# Altium schematic sheet Power.SchDoc
size 420 x 297 mm; Address1: Address1; Address2: Address2; Address3: Address3; Address4: Address4; SheetNumber: 1; Scale: 1:1; Разраб.: Иванов; Обозначение документа: Power; Пров.: Петров; Утв.: Сидоров; Наименование организации: ОАО "Концерн "МПО-Гидроприбор"; Перв. применение: АБВГ.123456.000; Наименование изделия 1: Плата; Наименование изделия 2: Схема электрическая; Наименование изделия 3: принципиальная; Нач. отд.: Нач. отд.; Фамилия нач. отд.: Сидоров
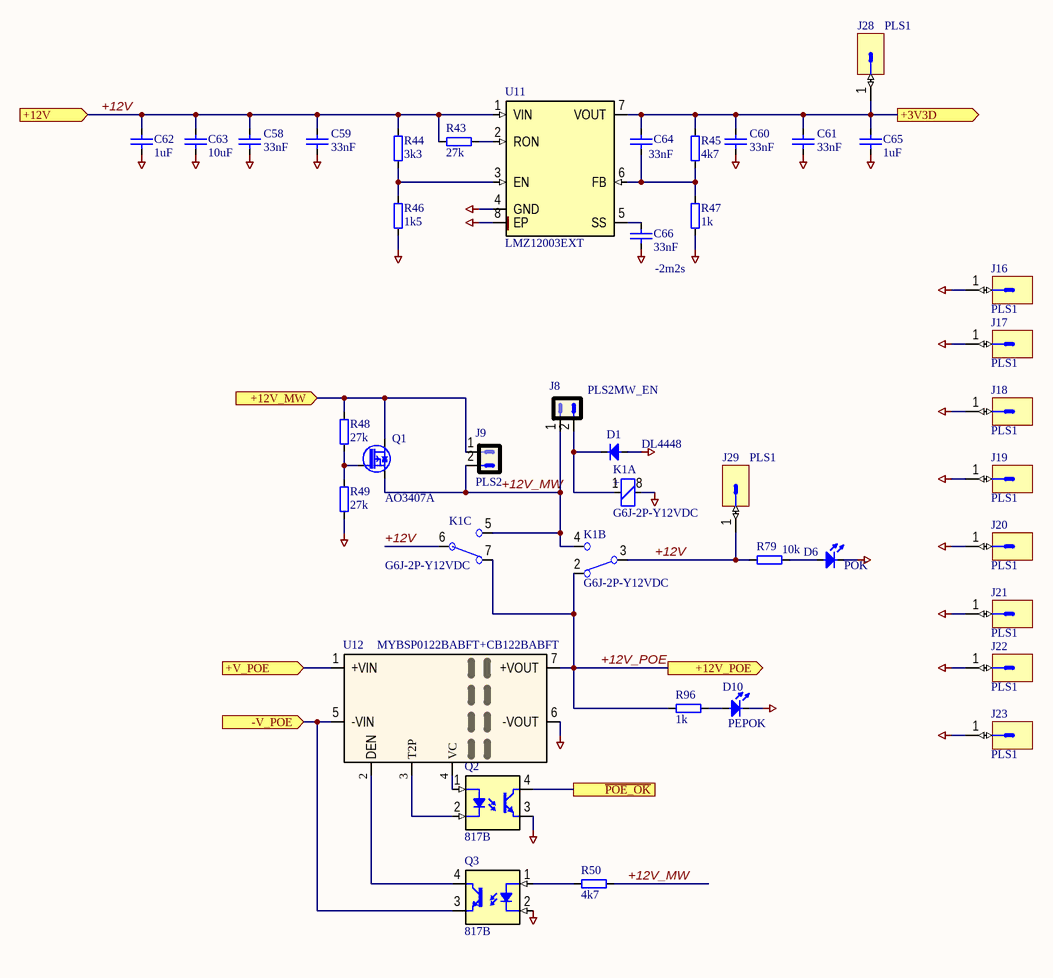
[diagram p0: Power.SchDoc]

## Parts
C58  33nF  [CAPC1608X87N]
C59  33nF  [CAPC1608X87N]
C60  33nF  [CAPC1608X87N]
C61  33nF  [CAPC1608X87N]
C62  1uF  [SMD0805CAP]
C63  10uF  [SMD0805CAP]
C64  33nF  [SMD0805CAP]
C65  1uF  [SMD0805CAP]
C66  33nF  [CAPC1608X87N]
D1  DL4448  [DIOMELF3515N]
D6  POK  [LED_OSRAM_LGR971]
D10  PEPOK  [LED_OSRAM_LGR971]
J8  PLS2MW_EN  [PLS2]
J9  PLS2  [PLS2]
J16  PLS1  [PLS1]
J17  PLS1  [PLS1]
J18  PLS1  [PLS1]
J19  PLS1  [PLS1]
J20  PLS1  [PLS1]
J21  PLS1  [PLS1]
J22  PLS1  [PLS1]
J23  PLS1  [PLS1]
J28  PLS1  [PLS1]
J29  PLS1  [PLS1]
K1  G6J-2P-Y12VDC  [REL_OMRON_G6J-2P-Y]  (parts A,B,C of 3)
Q1  AO3407A  [SOT95P229X119-3N]
Q2  817B  [DIP4-300]
Q3  817B  [DIP4-300]
R43  27k  [SMD0805RES]
R44  3k3  [SMD0805RES]
R45  4k7  [RESC1608X64N]
R46  1k5  [SMD0805RES]
R47  1k  [SMD0805RES]
R48  27k  [SMD0805RES]
R49  27k  [SMD0805RES]
R50  4k7  [SMD0805RES]
R79  10k  [SMD0805RES]
R96  1k  [SMD0805RES]
U11  LMZ12003EXT  [NATIONAL_TO-PMOD-7 (TZA07A)]
U12  MYBSP0122BABFT+CB122BABFT  [MURATA_MYBSP0122BABFT_0 - DUPLICATE]

## Ports
+3V3D (out), +12V (in), +12V_MW (in), +12V_POE (out), +V_POE (in), -V_POE (in), ~{POE_OK}

## Nets
GND: C58.1 C59.1 C60.1 C61.1 C62.1 C63.1 C65.1 C66.1 D1.2(A) D6.1(C) D10.1(C) J16.1 J17.1 J18.1 J19.1 J20.1 J21.1 J22.1 J23.1 K1.8 Q2.3(E) Q3.2(C) R46.2 R47.2 R49.2 U11.4(GND) U11.8(EP) U12.6(-VOUT)
+3V3D: C60.2 C61.2 C64.2 C65.2 J28.1 R45.1 U11.7(VOUT) ; port +3V3D
+12V: C58.2 C59.2 C62.2 C63.2 J29.1 K1.3(C) K1.6(C) R43.1 R44.1 R79.1 U11.1(VIN) ; port +12V
+12V_MW: J8.1 J9.2 K1.4(NO) K1.5(NO) Q1.2(S) R50.2
+12V_MW: J9.1 Q1.3(D) R48.1 ; port +12V_MW  [a separate net that carries the same name]
+12V_POE: K1.2(NC) K1.7(NC) R96.1 U12.7(+VOUT) ; port +12V_POE
+V_POE: U12.1(+VIN) ; port +V_POE
-V_POE: Q3.3(E) U12.5(-VIN) ; port -V_POE
~{POE_OK}: Q2.4(C) ; port ~{POE_OK}
NetC64_1: C64.1 R45.2 R47.1 U11.6(FB)
NetC66_2: C66.2 U11.5(SS)
NetD1_1: D1.1(C) J8.2 K1.1
NetD6_2: D6.2(A) R79.2
NetD10_2: D10.2(A) R96.2
NetQ1_1: Q1.1(G) R48.2 R49.1
NetQ2_1: Q2.1(A) U12.4(VC)
NetQ2_2: Q2.2(C) U12.3(T2P)
NetQ3_1: Q3.1(A) R50.1
NetQ3_4: Q3.4(C) U12.2(DEN)
NetR43_2: R43.2 U11.2(RON)
NetR44_2: R44.2 R46.1 U11.3(EN)

## Notes on the sheet
- -2m2s
- Подп. и дата
- Инв. № дубл.
- Взам. инв. №
- Инв. № подл.
- Изм.
- Лист
- № докум.
- Подп.
- Дата
- Копировал
- Формат А3
- (in symbol G6J-2P-Y 12VDC, part A) +

## Library data of the parts
C58-C61 C66 = C0603: Чип конденсатор 0603; Voltage: 50V; Vendor: Vishay; DielectricType: X5R; SMD Solders: 2; Solder Option: RM; Tolerance: 20%; Pkg: SMD0603; Device: Cap603; Value: 33nF; Price: 2
C62-C65 = C0805: Чип конденсатор 0805; Voltage: 25V; Vendor: Vishay; DielectricType: X5R; SMD Solders: 2; Solder Option: RM; Tolerance: 20%; Pkg: SMD0805; Device: Cap0805; Price: 2
  C62 C65: Value: 1uF
  C63: Value: 10uF
  C64: Value: 33nF
D1 = DL4448: Fast diode; SMD Solders: 2; Vendor: Shenzhen Luguang Electronic Technology; Voltage: 100; Solder Option: RM; Pkg: MiniMelf (DL35); Name to order: SF18; Current: 150; Price: 10; Device: DL4448
D6 D10 = LED0805: Чип светодиод 0805; Vendor: KB; SMD Solders: 2; Solder Option: RM; Pkg: SMD0805; THD Solders: 0; Price: 10; Device: LED0805
  D6: Value: POK
  D10: Value: PEPOK
J8 = PLS2: Vendor: Confly; Value: MW_EN; SMD Solders: 0; Solder Option: RM; THD Solders: 2; Price: 1; Device: PLS2
J9 = PLS2: Vendor: Confly; SMD Solders: 0; Solder Option: RM; THD Solders: 2; Price: 1; Device: PLS2
J16-J23 J28 J29 = PLS1: Штырь PLS1; Vendor: Confly; SMD Solders: 0; Solder Option: RM; THD Solders: 1; Price: 1; Device: PLS1
K1 = G6J-2P-Y 12VDC: Электромагнитное реле; Vendor: Omron; Voltage: 110V; SMD Solders: 0; Solder Option: RM; Pkg: 11x6mm; THD Solders: 8; Current: 9mA; Value: 12VDC; Price: 200; Device: G6J-2P-Y; Name to order: G6J-2P-Y 12VDC
Q1 = AO3407A: PMOS; Vendor: UMW; Pkg: SOT23; SMD Solders: 3; Solder Option: RM; THD Solders: 0; Voltage: -30V; Price: 10; Device: AO3407A; Name to order: AO3407A
Q2 Q3 = 817B: Optotransistor; Pkg: DIP4; SMD Solders: 0; Solder Option: RM; THD Solders: 4; Vendor: UMW; Voltage: 35V; Device: 817B; Price: 10; Name to order: 817B; Current: 0
R43 R44 R46-R50 R79 R96 = R0805: Чип резистор 0805; Vendor: Vishay; SMD Solders: 2; Solder Option: RM; TC: 100ppm/C; Tolerance: 1%; Pkg: SMD0805; Pwr: 125mW; Device: Res0805; Price: 2
  R43 R48 R49: Value: 27k
  R44: Value: 3k3
  R46: Value: 1k5
  R47 R96: Value: 1k
  R50: Value: 4k7
  R79: Value: 10k
R45 = R0603: Чип резистор 0603; Vendor: Vishay; SMD Solders: 2; Solder Option: RM; TC: 100ppm/C; Tolerance: 1%; Pkg: SMD0603; Pwr: 60mW; Device: Res603; Price: 2; Value: 4k7
U11 = LMZ12003: DC-DC Power Module; Vendor: Texas Instruments; Pkg: NDW 7; SMD Solders: 8; Solder Option: EXT; THD Solders: 0; Price: 11000; Device: LMZ12003; Name to order: LMZ12003EXT; thVoltage: -; PkgCode: EXT
U12 = MYBSP0122BABFT: POE isolated DC-DC 24W; Vendor: Murata; SMD Solders: 7; Solder Option: RM; Pkg: 35x23mm; Voltage: +12V; THD Solders: 0; Name to order: MYBSP0; Value: 122BABFT; Price: 1000; Device: MYBSP0122BABFT+CB